# EAGLE design Eye-of-Ord-v1.8 (EAGLE 7.7.0)
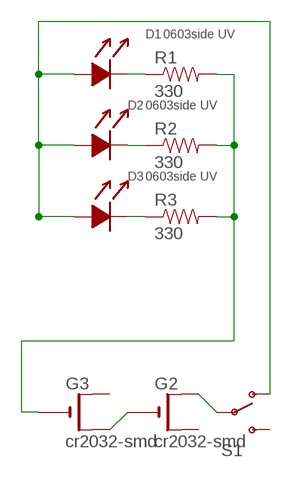
[diagram p0: schematic, sheet 1]

## Parts
D1  0603side UV  0603SIDELED  [SMD-0603-LED-SIDE]
D2  0603side UV  0603SIDELED  [SMD-0603-LED-SIDE]
D3  0603side UV  0603SIDELED  [SMD-0603-LED-SIDE]
G2  cr2032-smd  CR2032SMT  [CR2032-SMD]
G3  cr2032-smd  CR2032SMT  [CR2032-SMD]
R1  330  RESISTOR0603-RES  [0603-RES]
R2  330  RESISTOR0603-RES  [0603-RES]
R3  330  RESISTOR0603-RES  [0603-RES]
S1  SWITCH-SPDT-SMD-A  [SWITCH-SPST-SMD-A]

## Nets
GND: G3.- R1.2 R2.2 R3.2
N$1: G2.- G3.+$2(+1)
N$3: D2.C(K) R2.1
N$4: D3.C(K) R3.1
N$5: D1.C(K) R1.1
N$6: G2.+$1(+) S1.2(P)
VCC: D1.A D2.A D3.A S1.1(O)
Unconnected: G2.+$2(+1) G3.+$1(+) S1.3(S)

## Library data of the parts
D1-D3 = hh-led-2019:0603SIDELED
G2 G3 = smd-cr2032-correction:CR2032; DIGIKEY_PART_ID: BK-913-ND
R1-R3 = SparkFun-Resistors:RESISTOR: Resistor Basic schematic elements and footprints for 0603, 1206, and PTH resistors.; DIGIKEY_PART_ID: P100BZCT-ND
S1 = SparkFun-Electromechanical:SWITCH-SPDT: SPDT Switch Simple slide switch, Spark Fun Electronics SKU : COM-00102 DPDT SMT slide switch, AYZ0202, SWCH-08179; DIGIKEY_PART_ID: 679-1847-1-ND; PROD_ID: SWCH-10651

## Board
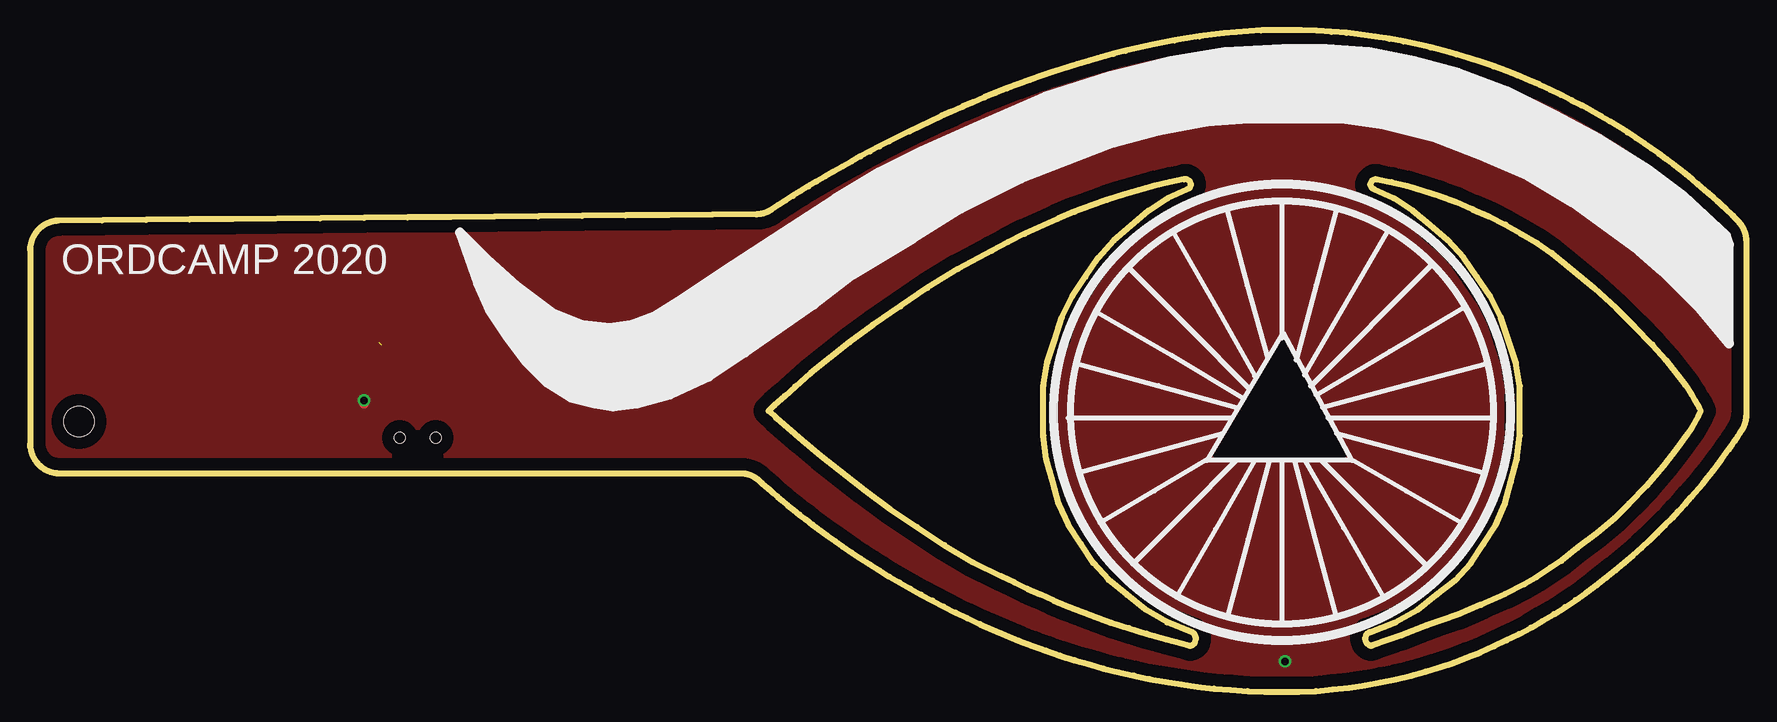
[diagram p1: board, top side]
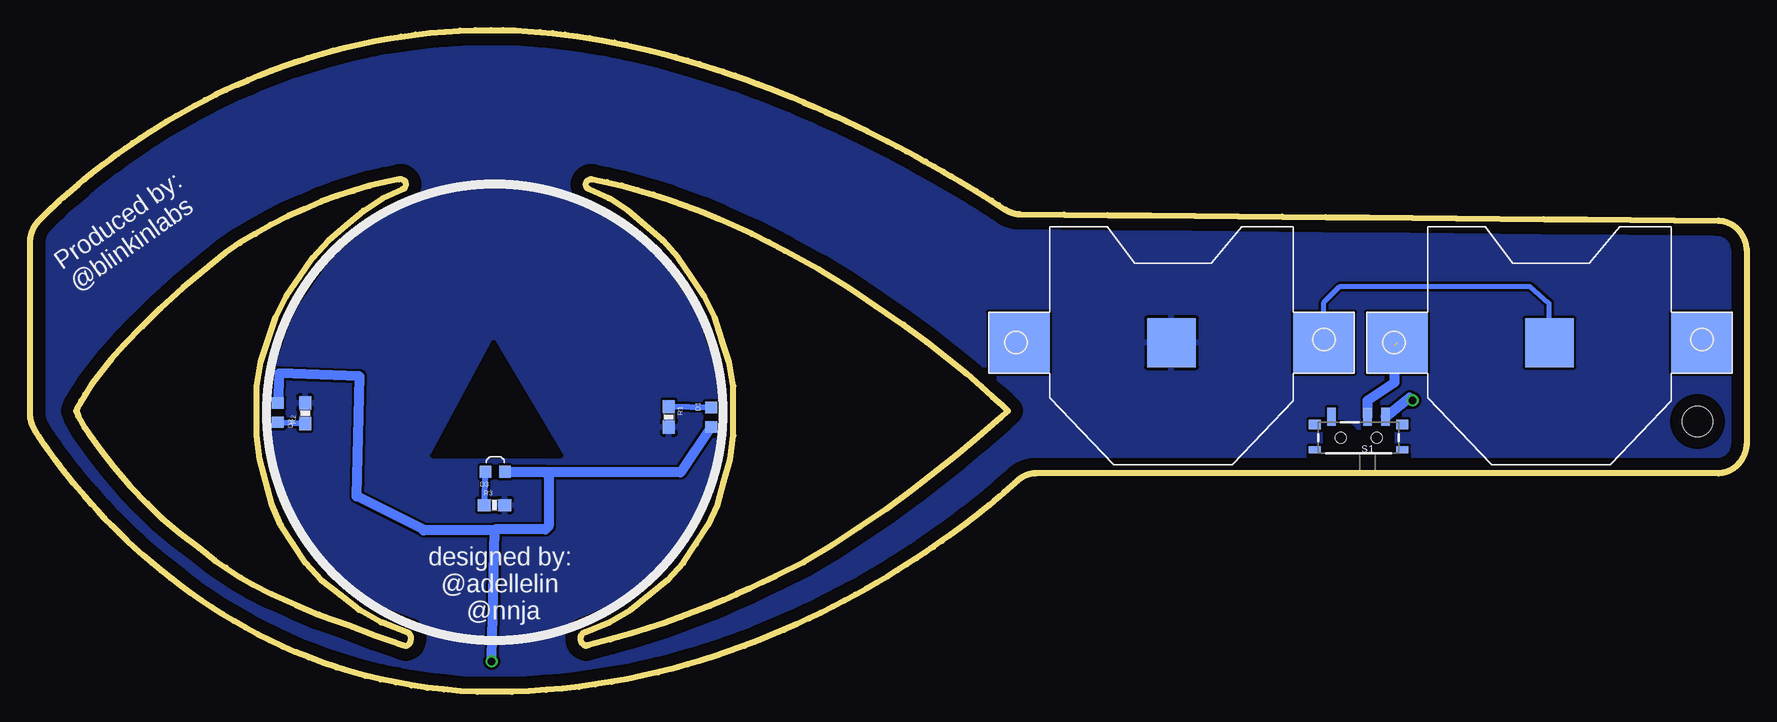
[diagram p2: board, bottom side, seen from below]

Size 143.05 x 55.16 mm. Coordinates in mm from the lower left corner, seen from the top.
Outline: 61.63,40.1 61.65,40.11 61.68,40.12 61.7,40.14 61.72,40.15 61.75,40.17 61.77,40.18 62.34,40.56 62.94,40.94 63.57,41.33 64.2,41.73 64.86,42.13 65.55,42.54 66.24,42.95 66.95,43.36 67.7,43.78 68.44,44.2 69.21,44.62 70,45.04 70.79,45.46 71.6,45.88 73.27,46.72 74.13,47.13 75.01,47.54 75.88,47.95 76.78,48.36 77.69,48.75 78.6,49.15 79.53,49.54 80.47,49.91 81.41,50.29 82.37,50.65 83.34,51 84.3,51.35 85.28,51.68 87.26,52.31 88.26,52.61 89.27,52.89 90.28,53.17 91.29,53.43 93.33,53.9 94.35,54.11 95.38,54.29 96.41,54.48 97.44,54.63 98.47,54.76 99.5,54.89 100.53,54.99 102.59,55.12 103.61,55.16 104.64,55.16 105.94,55.16 107.22,55.1 108.46,55.01 109.71,54.92 110.92,54.78 112.11,54.6 113.3,54.43 114.46,54.21 116.71,53.71 117.81,53.43 118.87,53.13 119.94,52.82 120.97,52.48 121.97,52.12 122.97,51.76 123.94,51.38 124.88,50.98 125.81,50.58 126.72,50.17 127.59,49.74 128.46,49.32 129.29,48.88 130.9,47.99 131.66,47.53 133.13,46.63 133.82,46.18 134.48,45.73 135.15,45.28 135.77,44.83 136.36,44.4 136.95,43.96 137.5,43.54 138.01,43.13 138.52,42.71 139,42.32 139.87,41.57 140.27,41.21 140.63,40.88 140.99,40.55 141.31,40.25 141.88,39.7 142.12,39.46 142.32,39.26 142.35,39.23 142.37,39.2 142.4,39.16 142.43,39.13 142.46,39.1 142.51,39.04 142.53,39 142.58,38.94 142.61,38.9 142.63,38.87 142.65,38.83 142.67,38.8 142.71,38.72 142.73,38.69 142.75,38.65 142.77,38.61 142.79,38.58 142.81,38.54 142.82,38.5 142.84,38.46 142.86,38.42 142.87,38.38 142.89,38.35 142.9,38.31 142.91,38.27 142.93,38.23 142.94,38.19 142.95,38.15 142.96,38.11 142.97,38.07 142.98,38.02 142.99,37.98 143,37.94 143.01,37.9 143.01,37.86 143.02,37.82 143.02,37.78 143.03,37.73 143.03,37.69 143.04,37.65 143.04,37.61 143.04,37.56 143.04,37.52 143.05,37.48 143.05,23.17 143.05,23.14 143.04,23.08 143.04,23.05 143.04,23.01 143.04,22.98 143.03,22.95 143.03,22.92 143.03,22.89 143.02,22.86 143.02,22.83 143.01,22.8 143.01,22.77 143,22.74 143,22.7 142.99,22.67 142.99,22.64 142.98,22.61 142.97,22.58 142.96,22.52 142.95,22.49 142.93,22.43 142.92,22.4 142.91,22.37 142.9,22.34 142.89,22.32 142.87,22.26 142.86,22.23 142.85,22.2 142.84,22.17 142.83,22.14 142.81,22.11 142.8,22.09 142.79,22.06 142.77,22.03 142.76,22 142.75,21.97 142.73,21.95 142.72,21.92 142.7,21.89 142.69,21.87 142.67,21.84 142.65,21.81 142.64,21.79 142.49,21.55 142.3,21.27 142.07,20.93 141.84,20.59 141.58,20.21 140.96,19.36 140.61,18.89 140.22,18.39 139.83,17.89 139.4,17.36 138.45,16.26 137.94,15.68 137.39,15.08 136.84,14.49 136.24,13.88 135.61,13.26 134.98,12.64 134.3,12.01 133.59,11.38 132.87,10.75 132.12,10.12 131.32,9.5 130.52,8.87 129.68,8.26 128.81,7.66 127.93,7.06 127.01,6.47 126.05,5.91 125.09,5.35 124.08,4.81 123.04,4.3 122,3.79 120.91,3.32 119.79,2.88 118.66,2.44 117.5,2.04 116.29,1.69 115.08,1.34 113.83,1.03 112.54,0.78 111.25,0.53 109.92,0.34 108.55,0.2 107.17,0.07 105.76,0 102.86,0 101.44,0.06 100.05,0.16 98.66,0.27 97.29,0.42 95.95,0.62 94.61,0.82 93.3,1.07 92.01,1.35 90.73,1.63 89.48,1.95 88.25,2.3 87.03,2.65 85.84,3.03 84.68,3.44 83.52,3.84 82.4,4.27 80.21,5.17 79.16,5.64 78.14,6.12 77.12,6.6 76.13,7.1 75.19,7.6 74.24,8.1 73.34,8.6 72.47,9.11 71.6,9.61 70.78,10.12 69.99,10.62 69.21,11.12 68.46,11.61 67.76,12.09 67.07,12.57 66.41,13.04 65.19,13.94 64.63,14.37 64.11,14.78 63.59,15.19 63.12,15.57 62.7,15.92 62.28,16.27 61.91,16.59 61.58,16.87 61.26,17.15 60.99,17.39 60.77,17.59 60.75,17.62 60.72,17.64 60.66,17.69 60.63,17.71 60.6,17.74 60.57,17.76 60.54,17.78 60.51,17.8 60.48,17.82 60.45,17.84 60.39,17.88 60.36,17.9 60.33,17.92 60.3,17.94 60.27,17.95 60.2,17.99 60.17,18 60.14,18.02 60.1,18.03 60.07,18.04 60.04,18.06 60,18.07 59.97,18.08 59.9,18.11 59.87,18.12 59.83,18.13 59.8,18.14 59.76,18.15 59.73,18.16 59.69,18.16 59.66,18.17 59.62,18.18 59.59,18.19 59.55,18.19 59.52,18.2 59.48,18.2 59.44,18.21 59.37,18.21 59.34,18.22 59.3,18.22 59.26,18.22 59.23,18.22 2.32,18.22 2.24,18.22 2.16,18.23 2.08,18.24 2,18.25 1.92,18.27 1.84,18.29 1.77,18.31 1.69,18.33 1.62,18.36 1.54,18.39 1.47,18.42 1.4,18.45 1.33,18.49 1.19,18.57 1.12,18.61 1.06,18.65 1,18.7 0.93,18.75 0.88,18.8 0.82,18.85 0.76,18.91 0.7,18.96 0.65,19.02 0.6,19.08 0.55,19.14 0.5,19.21 0.45,19.27 0.41,19.34 0.37,19.41 0.33,19.48 0.29,19.55 0.25,19.62 0.22,19.7 0.19,19.77 0.16,19.85 0.13,19.93 0.11,20 0.08,20.08 0.06,20.17 0.03,20.33 0.02,20.41 0,20.59 0,20.67 0,36.81 0,36.9 0.02,37.07 0.03,37.15 0.05,37.24 0.06,37.32 0.08,37.4 0.11,37.48 0.13,37.56 0.16,37.63 0.19,37.71 0.22,37.79 0.25,37.86 0.29,37.93 0.32,38 0.36,38.07 0.41,38.14 0.45,38.21 0.49,38.27 0.59,38.4 0.64,38.46 0.7,38.51 0.75,38.57 0.81,38.63 0.87,38.68 0.93,38.73 0.99,38.78 1.05,38.83 1.11,38.87 1.18,38.91 1.25,38.95 1.31,38.99 1.38,39.03 1.53,39.09 1.6,39.12 1.67,39.15 1.75,39.17 1.83,39.19 1.9,39.21 1.98,39.23 2.06,39.24 2.14,39.25 2.22,39.26 2.3,39.27 2.39,39.27 6.02,39.3 9.65,39.33 13.28,39.37 16.92,39.4 24.18,39.47 27.82,39.5 31.45,39.53 35.08,39.57 38.72,39.6 42.35,39.63 45.98,39.67 49.62,39.7 53.25,39.73 56.88,39.77 60.52,39.8 60.54,39.8 60.57,39.8 60.6,39.8 60.63,39.8 60.65,39.81 60.68,39.81 60.71,39.81 60.74,39.81 60.76,39.82 60.79,39.82 60.82,39.82 60.85,39.83 60.87,39.83 60.9,39.84 60.93,39.84 60.95,39.85 60.98,39.85 61.01,39.86 61.04,39.86 61.06,39.87 61.09,39.88 61.12,39.89 61.14,39.89 61.17,39.9 61.2,39.91
Outline: 61.6,40.08 61.58,40.07 61.55,40.06 61.53,40.04
Outline: 61.5,40.03 61.48,40.02 61.45,40.01 61.43,40 61.4,39.99 61.38,39.97 61.35,39.96 61.33,39.95 61.3,39.94 61.27,39.94 61.22,39.92
Outline: 111.64,4.97 113.78,5.79 115.63,6.84 117.2,8.07 118.78,9.31 120.08,10.74 121.11,12.32 122.14,13.91 122.9,15.65 123.41,17.51 123.91,19.38 124.16,21.36 124.16,25.48 123.82,27.47 123.2,29.34 122.58,31.22 121.68,32.98 120.57,34.58 119.47,36.19 118.15,37.63 116.7,38.87 115.24,40.1 113.65,41.13 111.99,41.9 111.86,41.96 111.78,42.05 111.74,42.14 111.7,42.23 111.7,42.34 111.74,42.43 111.77,42.52 111.84,42.6 111.93,42.65 112.03,42.7 112.14,42.73 112.28,42.7 113.47,42.48 114.76,42.16 116.1,41.75 117.44,41.33 118.83,40.82 120.2,40.23 121.58,39.63 122.95,38.95 124.26,38.18 125.57,37.41 126.81,36.56 127.95,35.63 130.31,33.69 132.19,31.96 133.69,30.45 135.19,28.95 136.3,27.66 137.94,25.58 138.46,24.77 138.78,24.23 139.1,23.69 139.21,23.41 139.03,22.99 138.48,22.02 138.12,21.49 137.23,20.27 136.1,18.8 134.71,17.15 133.26,15.69 132.06,14.48 130.55,13.21 128.95,12 127.61,10.92 126.73,10.35 125.49,9.53 124.5,8.96 122.91,8.14 120.9,7.26 118.98,6.44 116.42,5.54 114.3,4.71 111.88,3.88 111.74,3.84 111.61,3.87 111.42,4.03 111.35,4.15 111.28,4.41 111.28,4.55 111.33,4.68 111.38,4.8 111.48,4.91 111.64,4.97
Outline: 96.8,4.97 94.76,5.8 92.97,6.85 91.43,8.09 89.89,9.33 88.6,10.76 87.56,12.34 86.53,13.92 85.75,15.66 85.23,17.52 84.7,19.38 84.44,21.36 84.44,25.48 84.78,27.47 85.38,29.34 85.99,31.22 86.86,32.98 87.95,34.58 89.04,36.19 90.33,37.63 91.77,38.87 93.21,40.1 94.79,41.13 96.45,41.9 96.58,41.96 96.66,42.05 96.7,42.14 96.74,42.23 96.74,42.34 96.7,42.43 96.67,42.52 96.6,42.6 96.51,42.65 96.41,42.7 96.3,42.73 96.16,42.7 94.97,42.48 93.71,42.18 92.41,41.81 91.1,41.44 89.76,41 87.03,39.99 85.64,39.42 82.87,38.17 81.49,37.48 80.13,36.75 77.34,35.25 74.79,33.66 72.52,32.13 70.26,30.6 68.29,29.12 65.04,26.54 63.76,25.43 62.89,24.65 62.02,23.87 61.56,23.41 62.18,22.84 64.34,20.97 65.88,19.68 69.55,16.81 71.68,15.24 73.93,13.73 76.19,12.23 78.58,10.79 80.93,9.65 82.03,9.12 83.09,8.61 84.17,8.13 85.26,7.64 86.37,7.17 88.79,6.24 90.09,5.78 91.57,5.32 93.04,4.85 94.68,4.37 96.56,3.88 96.7,3.84 96.83,3.87 96.92,3.95 97.02,4.03 97.09,4.14 97.16,4.4 97.15,4.55 97.1,4.67 97.05,4.8 96.96,4.91 96.8,4.97
Copper layers (1*16): Top 0.035mm / dielectric 1.5mm / Bottom 0.035mm
Design rules "default *": minimum track width 10mil, minimum drill 24mil, track to track 8mil, track to pad 8mil, pad to pad 8mil, via to via 8mil, smd to smd 8mil, copper to edge 40mil, drill to drill 8mil, minimum pad ring 10mil, minimum via ring 8mil, stop-mask expansion 4mil, vias tented up to drill 10mil, thermal gap 10mil
Holes 2.5 mm at 4.08,22.54
tRestrict: area 98.8,19.7 to 109.5,29.1
bRestrict: area 98.8,19.7 to 109.5,29.1

### Footprints (pad centres in the part's own frame; a part is rotated, then mirrored left to right if it is on the bottom)
SMD-0603-LED-SIDE = smd 0.95 x 1: A 0.8,0; C -0.8,0
CR2032-SMD = smd 5.08 x 5.08: +$1 -12.7,0; +$2 12.7,0 | smd 4.064 x 4.064: - 0,0
0603-RES = smd 1.1 x 1: 1 -0.85,0; 2 0.85,0
SWITCH-SPST-SMD-A = smd 0.7 x 1.5: 1 -2.25,-1.75; 2 -0.75,-1.75; 3 2.25,-1.75 | smd 1 x 0.6: GND1 -3.65,1; GND3 3.65,1 | smd 1 x 0.8: GND2 -3.65,-1.1; GND4 3.65,-1.1 | hole 0.9: -1.5,0; 1.5,0

### Placement (x,y rotation side)
D1  86.28,22.89 270 bottom
D2  122.38,23.27 90 bottom
D3  104.27,18.34 0 bottom
G2  16.42,29.1 0 bottom
G3  47.92,29.1 0 bottom
R1  89.8,22.92 270 bottom
R2  120.11,23.22 90 bottom
R3  104.34,15.57 0 bottom
S1  32.32,21.18 180 bottom

### Tracks (layer width: path | path; a pad name or v marks a point on that pad's centre or on a via)
GND
  pour Bottom: 2.58,43.79 62.58,46.04 94.33,58.04 119.33,57.79 151.83,43.79 151.83,18.04 124.58,-1.71 108.33,-3.21 87.83,0.04 60.58,15.79 -3.67,16.54 -3.92,41.54 1.08,42.29
N$1
  Bottom 0.406: G3.+$2 35.22,32.45 33.88,33.79 18.08,33.79 16.48,32.39 16.48,29.16 G2.-
N$3
  Bottom 0.5: D2.C R2.1
N$4
  Bottom 0.5: R3.1 D3.C
N$5
  Bottom 0.5: D1.C R1.1
N$6  (1 unrouted)
  Bottom 0.813: 29.33,28.89 29.33,25.79 31.58,24.29 S1.2
VCC  (via drill 0.6)
  Top 0.813: v27.83,24.29 27.83,24.04
  Bottom 0.813: 104.34,13.46 104.58,2.79 v104.58,2.54 | S1.1 28.08,24.54 v27.83,24.29 | D1.A 88.83,18.29 103.42,18.29 D3.A 100.13,18.34 99.83,18.04 99.83,13.79 100.08,13.54 104.25,13.54 104.34,13.46 | 104.34,13.46 110.25,13.46 110.33,13.54 115.83,16.29 115.58,26.29 122.28,26.54 D2.A
  pour Top: 4.58,41.29 61.08,41.79 88.58,53.79 111.33,58.79 138.83,49.04 152.83,37.79 150.33,19.79 137.58,7.04 118.08,-1.21 100.58,-1.96 80.83,3.79 60.33,16.54 25.58,16.29 -3.67,16.29 -4.42,37.29 1.58,43.04 4.33,41.29

### Text on the board
tNames: ORDCAMP 2020
bNames: Produced by: / @blinkinlabs | designed by: / @adellelin / @nnja